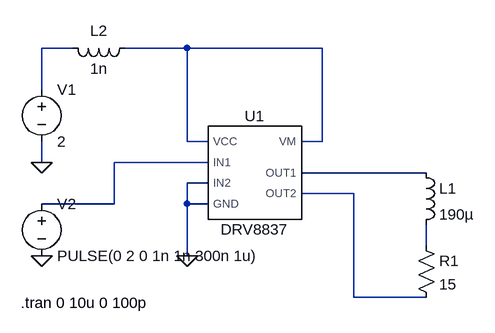
[diagram p0: schematic power-circuit.asc]
power-circuit.asc, the LTspice schematic file:
Version 4
SHEET 1 880 680
WIRE -48 -16 -96 -16
WIRE 128 -16 32 -16
WIRE 336 -16 128 -16
WIRE -96 48 -96 -16
WIRE 128 128 128 -16
WIRE 160 128 128 128
WIRE 336 128 336 -16
WIRE 336 128 304 128
WIRE -96 160 -96 128
WIRE 160 160 16 160
WIRE 496 176 304 176
WIRE 160 192 128 192
WIRE 384 208 304 208
WIRE 16 224 16 160
WIRE 16 224 -96 224
WIRE 128 224 128 192
WIRE 160 224 128 224
WIRE 496 288 496 256
WIRE 128 304 128 224
WIRE 384 368 384 208
WIRE 496 368 384 368
FLAG 128 304 0
FLAG -96 160 0
FLAG -96 304 0
SYMBOL AutoGenerated\\DRV8837 224 176 R0
SYMATTR InstName U1
SYMBOL ind 480 160 R0
SYMATTR InstName L1
SYMATTR Value 190µ
SYMATTR SpiceLine Rser=5
SYMBOL res 480 272 R0
SYMATTR InstName R1
SYMATTR Value 15
SYMBOL voltage -96 32 R0
WINDOW 123 0 0 Left 0
WINDOW 39 0 0 Left 0
SYMATTR InstName V1
SYMATTR Value 2
SYMBOL ind 48 -32 R90
WINDOW 0 5 56 VBottom 2
WINDOW 3 32 56 VTop 2
SYMATTR InstName L2
SYMATTR Value 1n
SYMBOL voltage -96 208 R0
WINDOW 123 0 0 Left 0
WINDOW 39 0 0 Left 0
SYMATTR InstName V2
SYMATTR Value PULSE(0 2 0 1n 1n 300n 1u)
TEXT -128 376 Left 2 !.tran 0 10u 0 100p

The netlist it stands for:
* power-circuit.asc
XU1 N003 0 N002 N002 0 N004 N005 DRV8837  ; pins IN1 IN2 VCC VM GND OUT1 OUT2
L1 N004 N006 190µ Rser=5
R1 N006 N005 15
V1 N001 0 2
L2 N002 N001 1n
V2 N003 0 PULSE(0 2 0 1n 1n 300n 1u)
.tran 0 10u 0 100p
.lib .\drv8837.lib
.backanno
.end